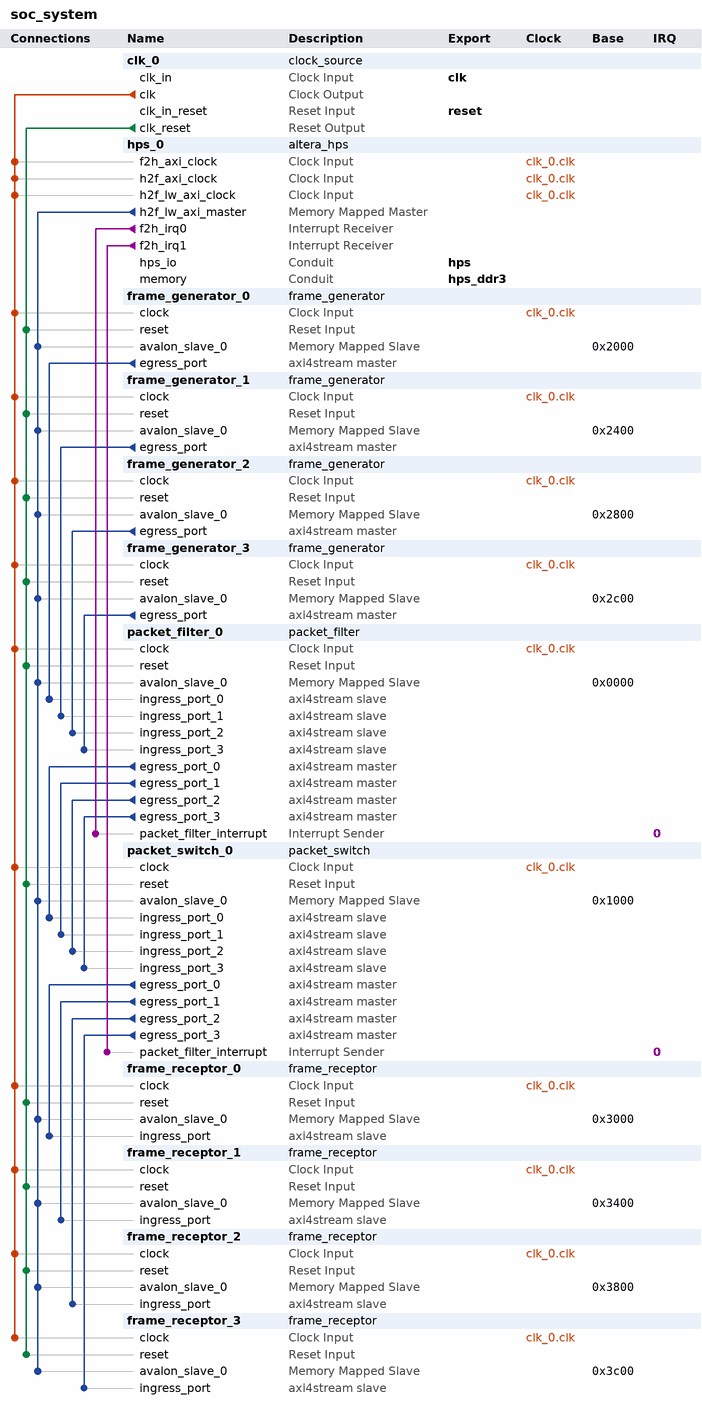
[diagram p0: system contents]
# Platform Designer (Qsys) system soc_system, Cyclone V 5CSEMA5F31C6
# Parameters at their usual value, and those the tool derives, are not listed.
package require -exact qsys 21.1
create_system soc_system
set_project_property DEVICE_FAMILY {Cyclone V}
set_project_property DEVICE 5CSEMA5F31C6

add_instance clk_0 clock_source 21.1
set_instance_parameter_value clk_0 clockFrequency 50000000

add_instance hps_0 altera_hps 21.1
set_instance_parameter_value hps_0 EMAC1_Mode RGMII
set_instance_parameter_value hps_0 EMAC1_PinMuxing {HPS I/O Set 0}
set_instance_parameter_value hps_0 F2SCLK_COLDRST_Enable false
set_instance_parameter_value hps_0 F2SCLK_DBGRST_Enable false
set_instance_parameter_value hps_0 F2SCLK_WARMRST_Enable false
set_instance_parameter_value hps_0 F2SINTERRUPT_Enable true
set_instance_parameter_value hps_0 F2S_Width 2
set_instance_parameter_value hps_0 FPGA_PERIPHERAL_OUTPUT_CLOCK_FREQ_EMAC0_GTX_CLK 125
set_instance_parameter_value hps_0 FPGA_PERIPHERAL_OUTPUT_CLOCK_FREQ_EMAC0_MD_CLK 2.5
set_instance_parameter_value hps_0 FPGA_PERIPHERAL_OUTPUT_CLOCK_FREQ_EMAC1_GTX_CLK 125
set_instance_parameter_value hps_0 FPGA_PERIPHERAL_OUTPUT_CLOCK_FREQ_EMAC1_MD_CLK 2.5
set_instance_parameter_value hps_0 HPS_PROTOCOL DDR3
set_instance_parameter_value hps_0 I2C0_Mode I2C
set_instance_parameter_value hps_0 I2C0_PinMuxing {HPS I/O Set 0}
set_instance_parameter_value hps_0 I2C1_Mode I2C
set_instance_parameter_value hps_0 I2C1_PinMuxing {HPS I/O Set 0}
set_instance_parameter_value hps_0 LWH2F_Enable true
set_instance_parameter_value hps_0 MEM_BANKADDR_WIDTH 3
set_instance_parameter_value hps_0 MEM_CLK_FREQ 400.0
set_instance_parameter_value hps_0 MEM_COL_ADDR_WIDTH 10
set_instance_parameter_value hps_0 MEM_DQ_WIDTH 32
set_instance_parameter_value hps_0 MEM_DRV_STR RZQ/7
set_instance_parameter_value hps_0 MEM_ROW_ADDR_WIDTH 15
set_instance_parameter_value hps_0 MEM_RTT_NOM RZQ/4
set_instance_parameter_value hps_0 MEM_RTT_WR RZQ/4
set_instance_parameter_value hps_0 MEM_TCL 11
set_instance_parameter_value hps_0 MEM_TFAW_NS 30.0
set_instance_parameter_value hps_0 MEM_TRAS_NS 35.0
set_instance_parameter_value hps_0 MEM_TRCD_NS 13.75
set_instance_parameter_value hps_0 MEM_TRFC_NS 260.0
set_instance_parameter_value hps_0 MEM_TRP_NS 13.75
set_instance_parameter_value hps_0 MEM_TRRD_NS 7.7
set_instance_parameter_value hps_0 MEM_VENDOR JEDEC
set_instance_parameter_value hps_0 MEM_WTCL 8
set_instance_parameter_value hps_0 QSPI_Mode N/A
set_instance_parameter_value hps_0 QSPI_PinMuxing Unused
set_instance_parameter_value hps_0 REF_CLK_FREQ 25.0
set_instance_parameter_value hps_0 S2FCLK_USER1CLK_Enable true
set_instance_parameter_value hps_0 S2FCLK_USER1CLK_FREQ 50.0
set_instance_parameter_value hps_0 S2FCLK_USER2CLK 5
set_instance_parameter_value hps_0 S2F_Width 2
set_instance_parameter_value hps_0 SDIO_Mode {4-bit Data}
set_instance_parameter_value hps_0 SDIO_PinMuxing {HPS I/O Set 0}
set_instance_parameter_value hps_0 SPIM1_Mode {Single Slave Select}
set_instance_parameter_value hps_0 SPIM1_PinMuxing {HPS I/O Set 0}
set_instance_parameter_value hps_0 STM_Enable false
set_instance_parameter_value hps_0 TIMING_BOARD_AC_SKEW 0.03
set_instance_parameter_value hps_0 TIMING_BOARD_AC_TO_CK_SKEW 0.0
set_instance_parameter_value hps_0 TIMING_BOARD_DQ_TO_DQS_SKEW 0.0
set_instance_parameter_value hps_0 TIMING_BOARD_MAX_CK_DELAY 0.03
set_instance_parameter_value hps_0 TIMING_BOARD_MAX_DQS_DELAY 0.02
set_instance_parameter_value hps_0 TIMING_BOARD_SKEW_BETWEEN_DQS 0.08
set_instance_parameter_value hps_0 TIMING_BOARD_SKEW_CKDQS_DIMM_MAX 0.16
set_instance_parameter_value hps_0 TIMING_BOARD_SKEW_CKDQS_DIMM_MIN 0.09
set_instance_parameter_value hps_0 TIMING_BOARD_SKEW_WITHIN_DQS 0.01
set_instance_parameter_value hps_0 TIMING_TDH 65
set_instance_parameter_value hps_0 TIMING_TDQSCK 255
set_instance_parameter_value hps_0 TIMING_TDQSQ 125
set_instance_parameter_value hps_0 TIMING_TDS 30
set_instance_parameter_value hps_0 TIMING_TIH 140
set_instance_parameter_value hps_0 TIMING_TIS 180
set_instance_parameter_value hps_0 TIMING_TQSH 0.4
set_instance_parameter_value hps_0 UART0_Mode {No Flow Control}
set_instance_parameter_value hps_0 UART0_PinMuxing {HPS I/O Set 0}
set_instance_parameter_value hps_0 USB1_Mode SDR
set_instance_parameter_value hps_0 USB1_PinMuxing {HPS I/O Set 0}
set_instance_parameter_value hps_0 desired_cfg_clk_mhz 50.0
set_instance_parameter_value hps_0 desired_qspi_clk_mhz 400.0

add_instance frame_generator_0 frame_generator 1.0
set_instance_parameter_value frame_generator_0 STUBBING 0

add_instance frame_generator_1 frame_generator 1.0
set_instance_parameter_value frame_generator_1 STUBBING 0

add_instance frame_generator_2 frame_generator 1.0
set_instance_parameter_value frame_generator_2 STUBBING 0

add_instance frame_generator_3 frame_generator 1.0
set_instance_parameter_value frame_generator_3 STUBBING 0

add_instance packet_filter_0 packet_filter 1.0
set_instance_parameter_value packet_filter_0 ADDR_WIDTH 11
set_instance_parameter_value packet_filter_0 ALMOST_FULL_THRESHOLD 760
set_instance_parameter_value packet_filter_0 NUM_CYCLONE_5CSEMA5_BLOCKS 4
set_instance_parameter_value packet_filter_0 STUBBING 0
set_instance_parameter_value packet_filter_0 TIMEOUT_CTR_WIDTH 9

add_instance packet_switch_0 packet_switch 1.0
set_instance_parameter_value packet_switch_0 DATA_WIDTH 16
set_instance_parameter_value packet_switch_0 IDX_WIDTH 2
set_instance_parameter_value packet_switch_0 N_PORTS 4
set_instance_parameter_value packet_switch_0 STUBBING 0

add_instance frame_receptor_0 frame_receptor 1.0
set_instance_parameter_value frame_receptor_0 CAN_RESET_POINTERS 0
set_instance_parameter_value frame_receptor_0 STUBBING 0

add_instance frame_receptor_1 frame_receptor 1.0
set_instance_parameter_value frame_receptor_1 CAN_RESET_POINTERS 0
set_instance_parameter_value frame_receptor_1 STUBBING 0

add_instance frame_receptor_2 frame_receptor 1.0
set_instance_parameter_value frame_receptor_2 CAN_RESET_POINTERS 0
set_instance_parameter_value frame_receptor_2 STUBBING 0

add_instance frame_receptor_3 frame_receptor 1.0
set_instance_parameter_value frame_receptor_3 CAN_RESET_POINTERS 0
set_instance_parameter_value frame_receptor_3 STUBBING 0

# connections
add_connection clk_0.clk frame_generator_0.clock clock
add_connection clk_0.clk frame_generator_1.clock clock
add_connection clk_0.clk frame_generator_2.clock clock
add_connection clk_0.clk frame_generator_3.clock clock
add_connection clk_0.clk frame_receptor_0.clock clock
add_connection clk_0.clk frame_receptor_1.clock clock
add_connection clk_0.clk frame_receptor_2.clock clock
add_connection clk_0.clk frame_receptor_3.clock clock
add_connection clk_0.clk hps_0.f2h_axi_clock clock
add_connection clk_0.clk hps_0.h2f_axi_clock clock
add_connection clk_0.clk hps_0.h2f_lw_axi_clock clock
add_connection clk_0.clk packet_filter_0.clock clock
add_connection clk_0.clk packet_switch_0.clock clock
add_connection clk_0.clk_reset frame_generator_0.reset reset
add_connection clk_0.clk_reset frame_generator_1.reset reset
add_connection clk_0.clk_reset frame_generator_2.reset reset
add_connection clk_0.clk_reset frame_generator_3.reset reset
add_connection clk_0.clk_reset frame_receptor_0.reset reset
add_connection clk_0.clk_reset frame_receptor_1.reset reset
add_connection clk_0.clk_reset frame_receptor_2.reset reset
add_connection clk_0.clk_reset frame_receptor_3.reset reset
add_connection clk_0.clk_reset packet_filter_0.reset reset
add_connection clk_0.clk_reset packet_switch_0.reset reset
add_connection hps_0.h2f_lw_axi_master frame_generator_0.avalon_slave_0 avalon
set_connection_parameter_value hps_0.h2f_lw_axi_master/frame_generator_0.avalon_slave_0 baseAddress 0x2000
add_connection hps_0.h2f_lw_axi_master frame_generator_1.avalon_slave_0 avalon
set_connection_parameter_value hps_0.h2f_lw_axi_master/frame_generator_1.avalon_slave_0 baseAddress 0x2400
add_connection hps_0.h2f_lw_axi_master frame_generator_2.avalon_slave_0 avalon
set_connection_parameter_value hps_0.h2f_lw_axi_master/frame_generator_2.avalon_slave_0 baseAddress 0x2800
add_connection hps_0.h2f_lw_axi_master frame_generator_3.avalon_slave_0 avalon
set_connection_parameter_value hps_0.h2f_lw_axi_master/frame_generator_3.avalon_slave_0 baseAddress 0x2c00
add_connection hps_0.h2f_lw_axi_master frame_receptor_0.avalon_slave_0 avalon
set_connection_parameter_value hps_0.h2f_lw_axi_master/frame_receptor_0.avalon_slave_0 baseAddress 0x3000
add_connection hps_0.h2f_lw_axi_master frame_receptor_1.avalon_slave_0 avalon
set_connection_parameter_value hps_0.h2f_lw_axi_master/frame_receptor_1.avalon_slave_0 baseAddress 0x3400
add_connection hps_0.h2f_lw_axi_master frame_receptor_2.avalon_slave_0 avalon
set_connection_parameter_value hps_0.h2f_lw_axi_master/frame_receptor_2.avalon_slave_0 baseAddress 0x3800
add_connection hps_0.h2f_lw_axi_master frame_receptor_3.avalon_slave_0 avalon
set_connection_parameter_value hps_0.h2f_lw_axi_master/frame_receptor_3.avalon_slave_0 baseAddress 0x3c00
add_connection hps_0.h2f_lw_axi_master packet_filter_0.avalon_slave_0 avalon
set_connection_parameter_value hps_0.h2f_lw_axi_master/packet_filter_0.avalon_slave_0 baseAddress 0x0000
add_connection hps_0.h2f_lw_axi_master packet_switch_0.avalon_slave_0 avalon
set_connection_parameter_value hps_0.h2f_lw_axi_master/packet_switch_0.avalon_slave_0 baseAddress 0x1000
add_connection frame_generator_0.egress_port packet_filter_0.ingress_port_0 axi4stream
add_connection frame_generator_1.egress_port packet_filter_0.ingress_port_1 axi4stream
add_connection frame_generator_2.egress_port packet_filter_0.ingress_port_2 axi4stream
add_connection frame_generator_3.egress_port packet_filter_0.ingress_port_3 axi4stream
add_connection packet_filter_0.egress_port_0 packet_switch_0.ingress_port_0 axi4stream
add_connection packet_filter_0.egress_port_1 packet_switch_0.ingress_port_1 axi4stream
add_connection packet_filter_0.egress_port_2 packet_switch_0.ingress_port_2 axi4stream
add_connection packet_filter_0.egress_port_3 packet_switch_0.ingress_port_3 axi4stream
add_connection packet_switch_0.egress_port_0 frame_receptor_0.ingress_port axi4stream
add_connection packet_switch_0.egress_port_1 frame_receptor_1.ingress_port axi4stream
add_connection packet_switch_0.egress_port_2 frame_receptor_2.ingress_port axi4stream
add_connection packet_switch_0.egress_port_3 frame_receptor_3.ingress_port axi4stream
add_connection hps_0.f2h_irq0 packet_filter_0.packet_filter_interrupt interrupt
set_connection_parameter_value hps_0.f2h_irq0/packet_filter_0.packet_filter_interrupt irqNumber 0
add_connection hps_0.f2h_irq1 packet_switch_0.packet_filter_interrupt interrupt
set_connection_parameter_value hps_0.f2h_irq1/packet_switch_0.packet_filter_interrupt irqNumber 0

# exported interfaces
add_interface clk clock sink
set_interface_property clk EXPORT_OF clk_0.clk_in
add_interface hps conduit end
set_interface_property hps EXPORT_OF hps_0.hps_io
add_interface hps_ddr3 conduit end
set_interface_property hps_ddr3 EXPORT_OF hps_0.memory
add_interface reset reset sink
set_interface_property reset EXPORT_OF clk_0.clk_in_reset

set_interconnect_requirement {$system} qsys_mm.clockCrossingAdapter HANDSHAKE
set_interconnect_requirement {$system} qsys_mm.enableEccProtection FALSE
set_interconnect_requirement {$system} qsys_mm.insertDefaultSlave FALSE
set_interconnect_requirement {$system} qsys_mm.maxAdditionalLatency 1

save_system soc_system.qsys
